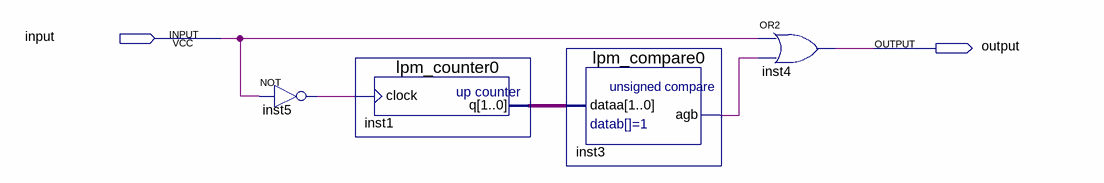
[diagram p0: schematic sheet]
// Quartus schematic wave_deformator.bdf as structural Verilog: 4 symbols, 2 pins
module wave_deformator (
  input  \input ,
  output \output 
);

  wire inst3_agb, inst5_out;
  wire [1:0] inst1_q;

  not inst5 (inst5_out, \input );
  lpm_counter0 inst1 (.clock(inst5_out), .q(inst1_q));
  lpm_compare0 inst3 (.dataa(inst1_q), .agb(inst3_agb));
  or inst4 (\output , \input , inst3_agb);
endmodule
